# EAGLE design board_componentes (EAGLE 6.5.0)
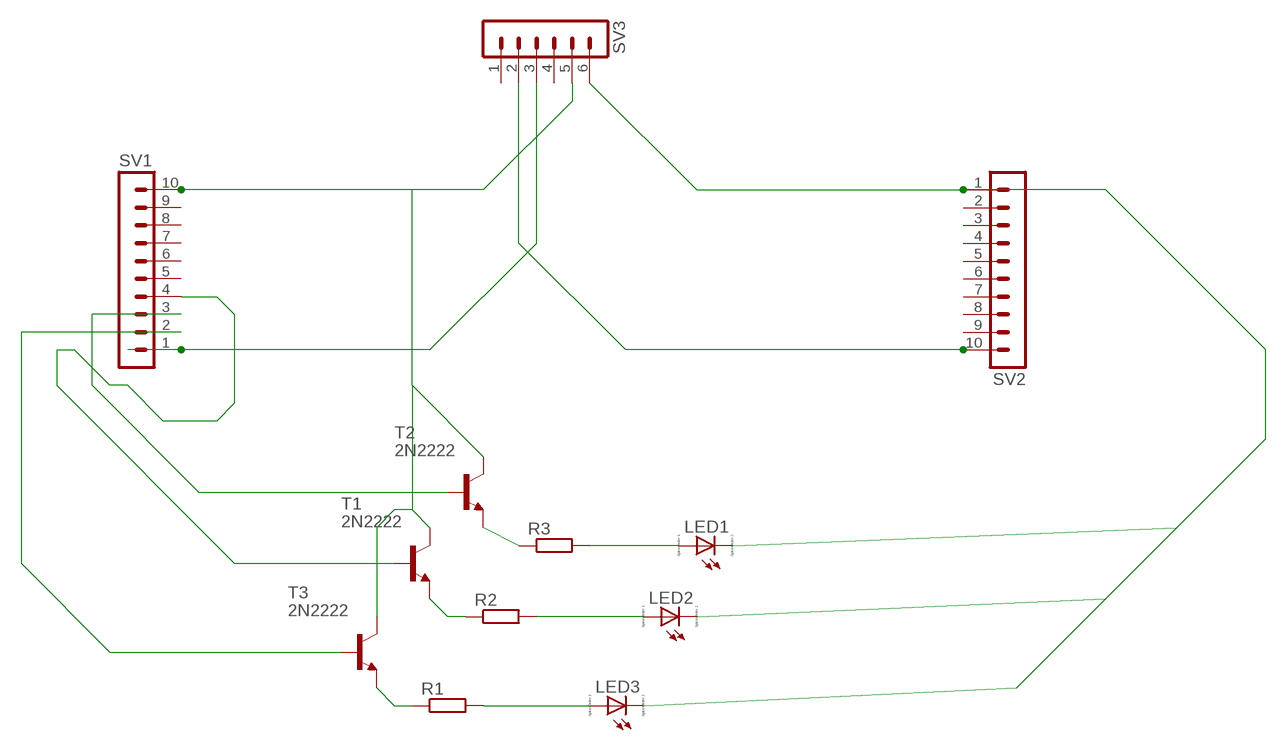
[diagram p0: schematic, sheet 1]

## Parts
LED1  LED_ELD260  [LED_LD260]
LED2  LED_ELD260  [LED_LD260]
LED3  LED_ELD260  [LED_LD260]
R1  R-EU_0207/12  [0207/12]
R2  R-EU_0207/12  [0207/12]
R3  R-EU_0207/12  [0207/12]
SV1  MA10-1  [MA10-1]
SV2  MA10-1  [MA10-1]
SV3  MA06-1  [MA06-1]
T1  2N2222  [TO18]
T2  2N2222  [TO18]
T3  2N2222  [TO18]

## Nets
N$1: LED1.K(C) LED2.K(C) LED3.K(C) SV2.1 SV3.6
N$3: SV1.10 SV3.5 T1.3(C) T2.3(C) T3.3(C)
N$4: SV1.4 T1.2(B)
N$5: SV1.2 T3.2(B)
N$18: SV1.3 T2.2(B)
N$19: SV2.10 SV3.2
N$22: R1.1 T3.1(E)
N$23: LED3.A R1.2
N$24: SV1.1 SV3.3
N$25: LED1.A R3.2
N$26: LED2.A R2.2
N$27: R2.1 T1.1(E)
N$28: R3.1 T2.1(E)
Unconnected: SV1.5 SV1.6 SV1.7 SV1.8 SV1.9 SV2.2 SV2.3 SV2.4 SV2.5 SV2.6 SV2.7 SV2.8 SV2.9 SV3.1 SV3.4

## Library data of the parts
LED1-LED3 = eagle-ltspice:LED_E: LED Source: http://www.osram.convergy.de Source: www.luxeon.com Source: www.kingbright.com; SPICEMODEL: NONE; SPICEPREFIX: D; SPICETYPE: diode
R1-R3 = resistor:R-EU_: RESISTOR, European symbol
SV1 SV2 = con-lstb:MA10-1: PIN HEADER; OC_FARNELL: unknown; OC_NEWARK: unknown
SV3 = con-lstb:MA06-1: PIN HEADER; OC_FARNELL: unknown; OC_NEWARK: unknown
T1-T3 = transistor:2N2222: NPN TRANSISTOR

## Board
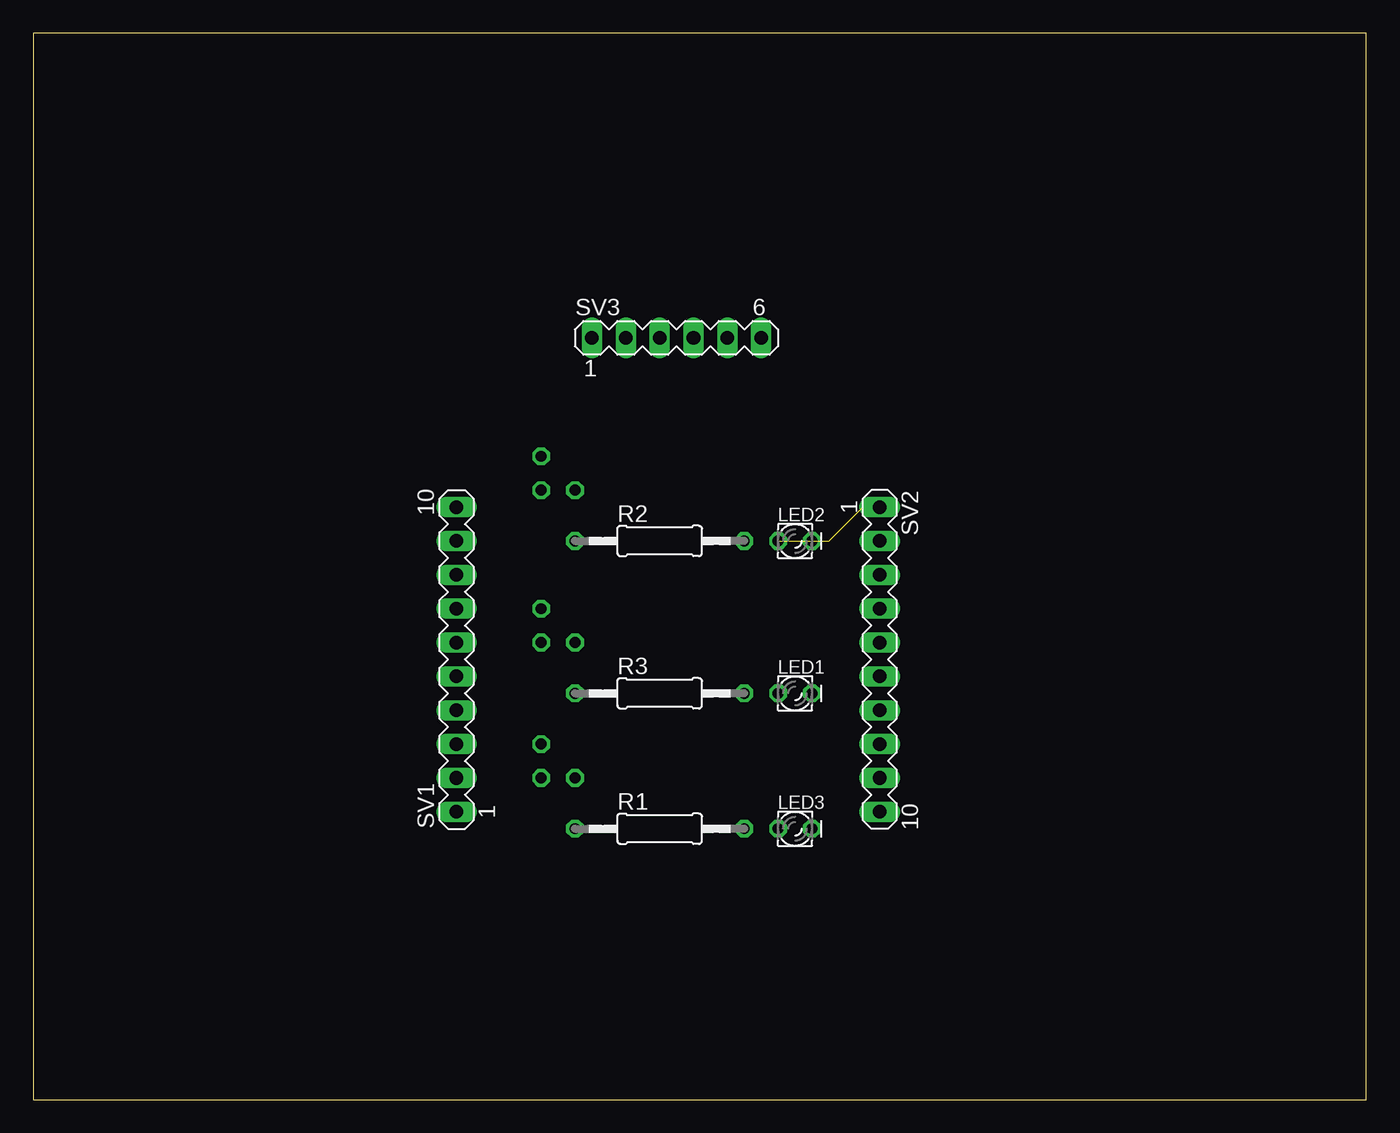
[diagram p1: board, top side]
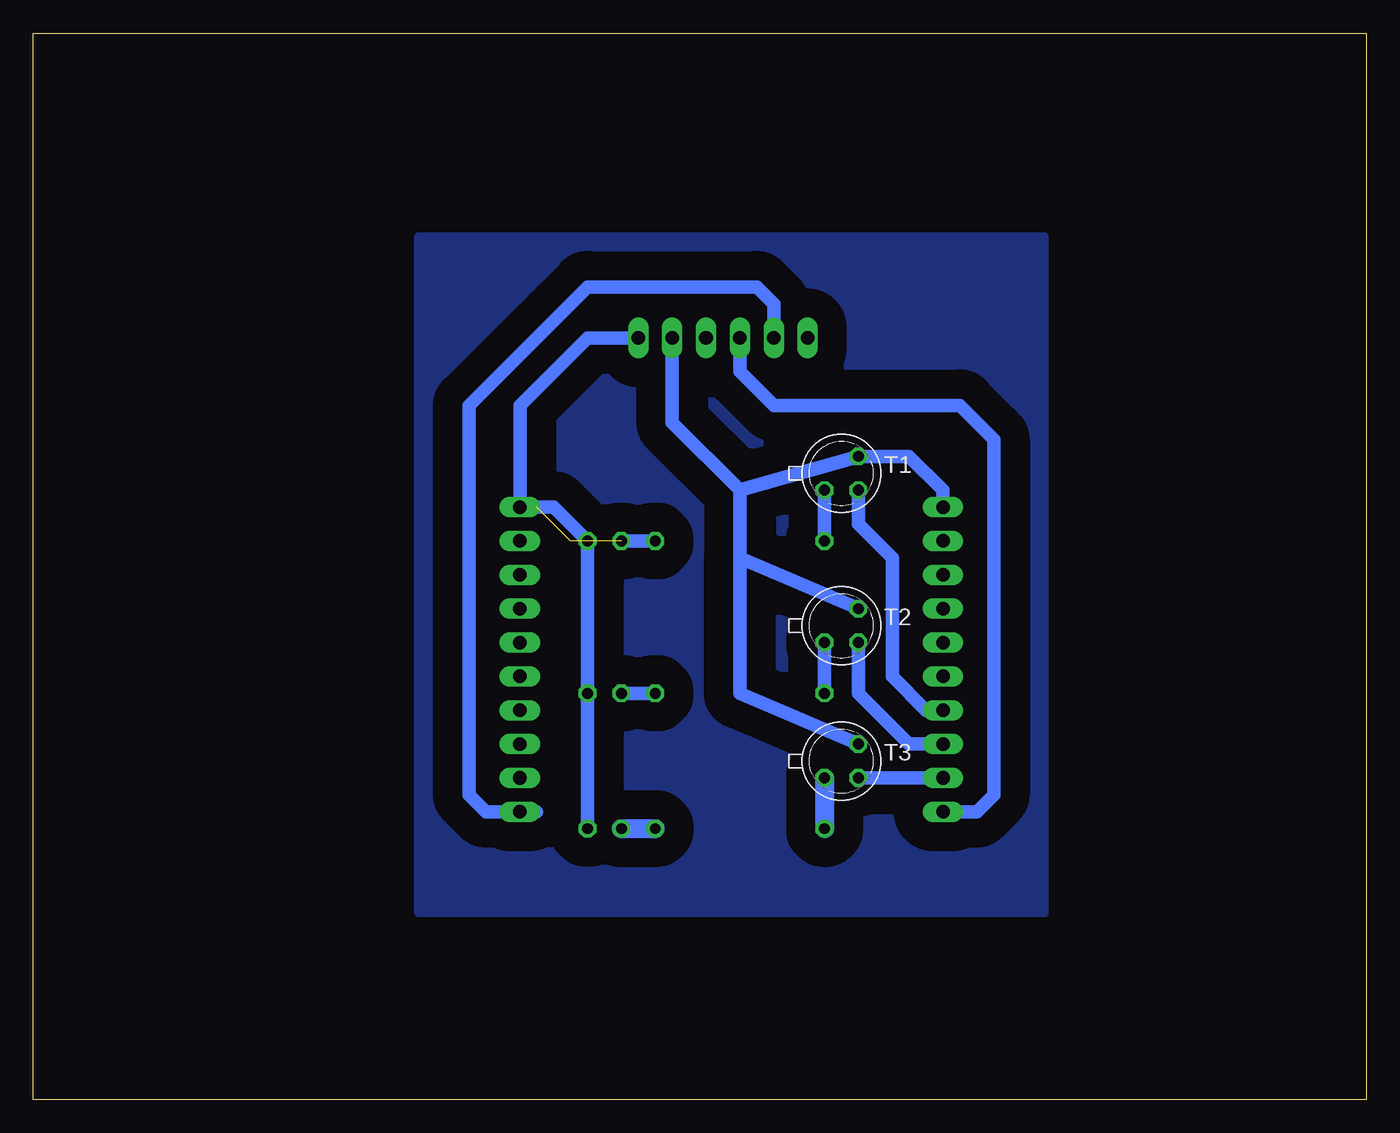
[diagram p2: board, bottom side, seen from below]

Size 100 x 80 mm. Coordinates in mm from the lower left corner, seen from the top.
Outline: 0,0 100,0 100,80 0,80 0,0
Copper layers (1*16): Top 0.035mm / dielectric 1.5mm / Bottom 0.035mm
Design rules "default": minimum track width 10mil, minimum drill 24mil, track to track 8mil, track to pad 8mil, pad to pad 8mil, via to via 8mil, smd to smd 8mil, copper to edge 40mil, drill to drill 8mil, minimum pad ring 10mil, minimum via ring 8mil, stop-mask expansion 4mil, vias tented up to drill 0mil, thermal gap 10mil

### Footprints (pad centres in the part's own frame; a part is rotated, then mirrored left to right if it is on the bottom)
LED_LD260 = drill 0.813 octagon: A -1.27,0; K 1.27,0
0207/12 = drill 0.813 octagon: 1 -6.35,0; 2 6.35,0
MA10-1 = drill 1.016 long: 1 -11.43,0; 2 -8.89,0; 3 -6.35,0; 4 -3.81,0; 5 -1.27,0; 6 1.27,0; 7 3.81,0; 8 6.35,0; 9 8.89,0; 10 11.43,0
MA06-1 = drill 1.016 long: 1 -6.35,0; 2 -3.81,0; 3 -1.27,0; 4 1.27,0; 5 3.81,0; 6 6.35,0
TO18 = drill 0.813 octagon: 1 -1.27,-1.27; 2 1.27,-1.27; 3 1.27,1.27

### Placement (x,y rotation side)
LED1  57.15,30.48 0 top
LED2  57.15,41.91 0 top
LED3  57.15,20.32 0 top
R1  46.99,20.32 0 top
R2  46.99,41.91 0 top
R3  46.99,30.48 0 top
SV1  31.75,33.02 90 top
SV2  63.5,33.02 270 top
SV3  48.26,57.15 0 top
T1  39.37,46.99 0 bottom
T2  39.37,35.56 0 bottom
T3  39.37,25.4 0 bottom

### Tracks (layer width: path | path; a pad name or v marks a point on that pad's centre or on a via)
N$1
  Bottom 1.016: SV3.6 58.42,57.15 63.5,52.07 SV2.1 60.96,44.45 LED2.K LED1.K LED3.K
N$2
  pour Bottom (isolate 2.184): 24.13,64.77 24.13,13.97 71.12,13.97 71.12,64.77
N$3
  Bottom 1.016: 52.07,55.88 SV3.5 52.07,50.8 46.99,45.72 | 46.99,45.72 T1.3 34.29,48.26 31.75,45.72 SV1.10 | 46.99,45.72 46.99,40.64 | 46.99,40.64 T2.3 | T3.3 46.99,30.48 46.99,40.64
N$4
  Bottom 1.016: T1.2 38.1,43.18 35.56,40.64 35.56,31.75 33.02,29.21 SV1.4
N$5
  Bottom 0.61: SV1.2
  Bottom 1.016: T3.2 SV1.2
N$18
  Bottom 1.016: T2.2 38.1,30.48 34.29,26.67 SV1.3
N$19
  Bottom 1.016: 62.23,21.59 SV2.10 66.04,21.59 67.31,22.86 67.31,52.07 58.42,60.96 45.72,60.96 44.45,59.69 SV3.2
N$22
  Bottom 1.422: T3.1 R1.1
N$23
  Bottom 1.422: R1.2 LED3.A
N$24
  Bottom 1.016: SV3.3 46.99,54.61 44.45,52.07 30.48,52.07 27.94,49.53 27.94,22.86 29.21,21.59 SV1.1
N$25
  Bottom 1.016: R3.2 LED1.A
N$26  (2 unrouted)
  Bottom 1.016: 62.23,44.45 63.5,44.45 | R2.2 LED2.A
N$27
  Bottom 1.016: T1.1 R2.1
N$28
  Bottom 1.016: R3.1 T2.1